# EAGLE design sanguinololu (EAGLE 5.11)
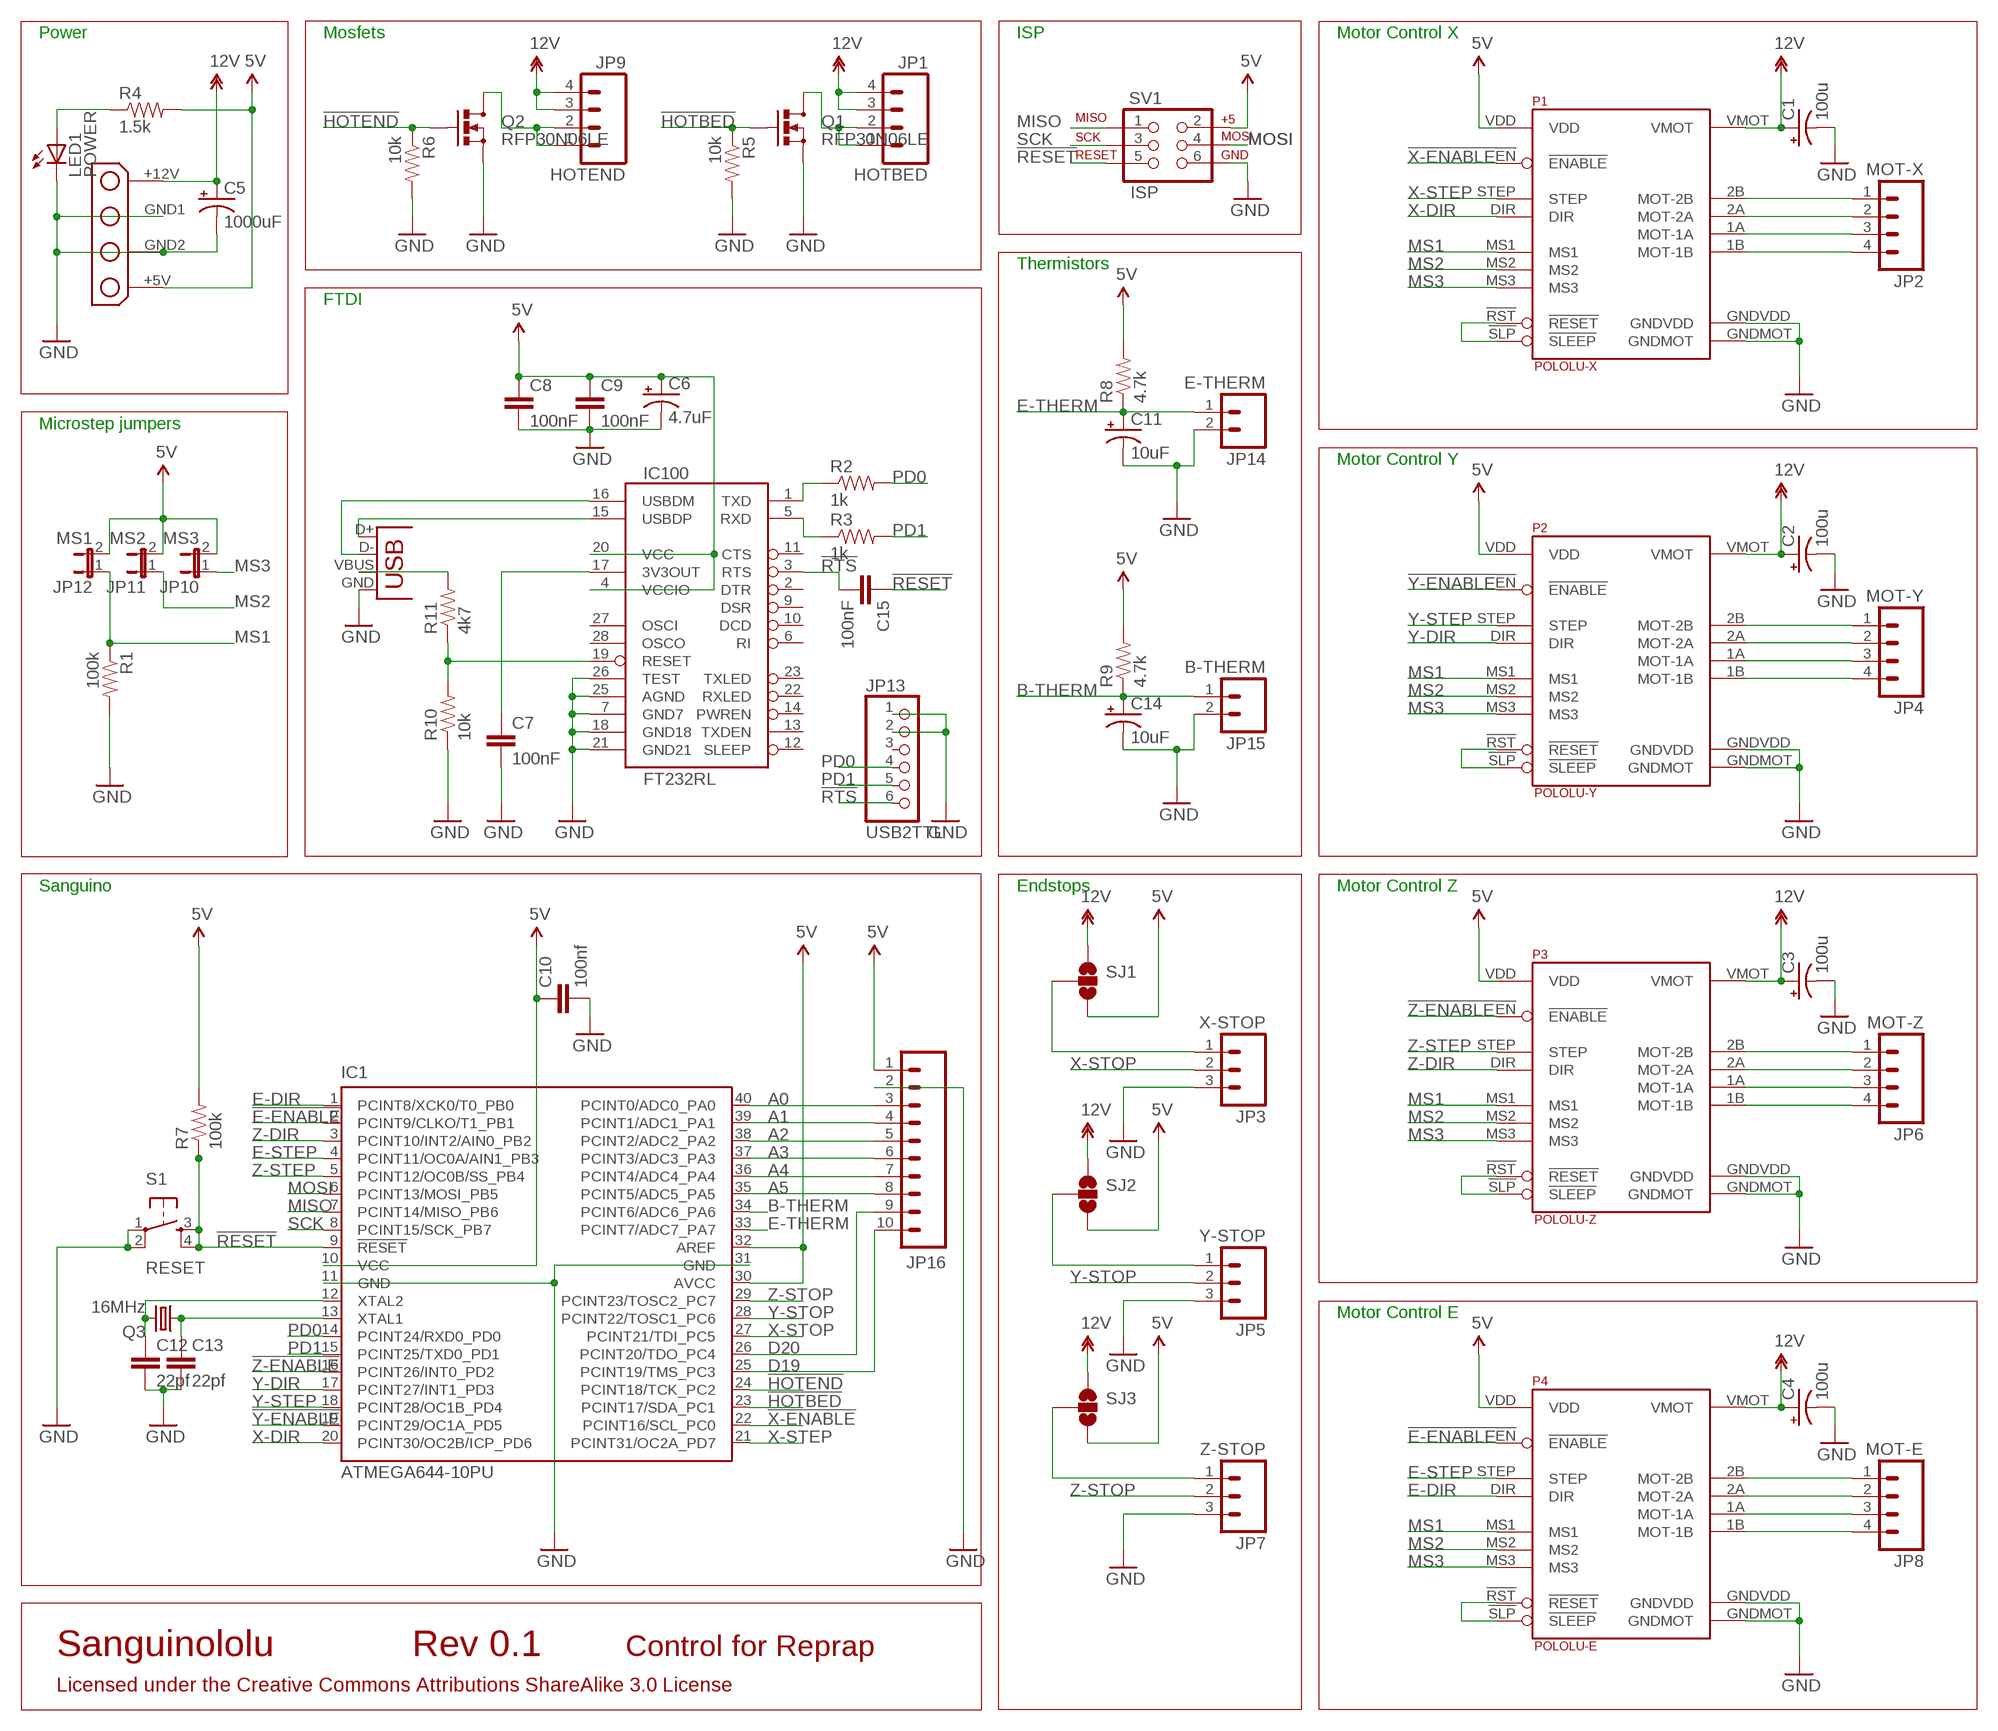
[diagram p0: schematic, sheet 1]

## Parts
C1  100u  CAP_POLPTH1  [CPOL-RADIAL-100UF-25V]
C2  100u  CAP_POLPTH1  [CPOL-RADIAL-100UF-25V]
C3  100u  CAP_POLPTH1  [CPOL-RADIAL-100UF-25V]
C4  100u  CAP_POLPTH1  [CPOL-RADIAL-100UF-25V]
C5  1000uF  CAP_POLPTH4  [CPOL-RADIAL-1000UF-25V]
C6  4.7uF  CAP_POLPTH2  [CPOL-RADIAL-10UF-25V]
C7  100nF  CAPPTH2  [CAP-PTH-SMALL2]
C8  100nF  CAPPTH2  [CAP-PTH-SMALL2]
C9  100nF  CAPPTH2  [CAP-PTH-SMALL2]
C10  100nf  CAPPTH2  [CAP-PTH-SMALL2]
C11  10uF  CAP_POLPTH2  [CPOL-RADIAL-10UF-25V]
C12  22pf  CAPPTH2  [CAP-PTH-SMALL2]
C13  22pf  CAPPTH2  [CAP-PTH-SMALL2]
C14  10uF  CAP_POLPTH2  [CPOL-RADIAL-10UF-25V]
C15  100nF  CAPPTH2  [CAP-PTH-SMALL2]
CONN1  DRIVEPWRVERTICAL  [MOLEX-4PIN-VERTICAL]
IC1  ATMEGA644-10PU  [DIL40]
IC100  FT232RL  FT232RLSSOP  [SSOP28DB]
J1  USB  USBPTH  [USB-B-PTH]
JP1  HOTBED  M04POLAR  [MOLEX-1X4]
JP2  MOT-X  M04POLAR  [MOLEX-1X4]
JP3  X-STOP  M03POLAR  [MOLEX-1X3]
JP4  MOT-Y  M04POLAR  [MOLEX-1X4]
JP5  Y-STOP  M03POLAR  [MOLEX-1X3]
JP6  MOT-Z  M04POLAR  [MOLEX-1X4]
JP7  Z-STOP  M03POLAR  [MOLEX-1X3]
JP8  MOT-E  M04POLAR  [MOLEX-1X4]
JP9  HOTEND  M04POLAR  [MOLEX-1X4]
JP10  MS3  JUMPER-2PTH  [1X02]
JP11  MS2  JUMPER-2PTH  [1X02]
JP12  MS1  JUMPER-2PTH  [1X02]
JP13  USB2TTL  PINHD-1X6  [1X06]
JP14  E-THERM  M02PTH  [1X02]
JP15  B-THERM  M02PTH  [1X02]
JP16  M10"  [1X10]
LED1  POWER  LED3MM  [LED3MM]
P1  POLOLU-X  POLOLU-ALLEGRO  [POLOLU-ALLEGRO-PTH]
P2  POLOLU-Y  POLOLU-ALLEGRO  [POLOLU-ALLEGRO-PTH]
P3  POLOLU-Z  POLOLU-ALLEGRO  [POLOLU-ALLEGRO-PTH]
P4  POLOLU-E  POLOLU-ALLEGRO  [POLOLU-ALLEGRO-PTH]
Q1  RFP30N06LE  MOSFET-NCHANNELPTH2  [TO220V]
Q2  RFP30N06LE  MOSFET-NCHANNELPTH2  [TO220V]
Q3  16MHz  CRYSTALHC49US  [HC49US]
R1  100k  RESISTORPTH1  [AXIAL-0.3]
R2  1k  RESISTORPTH1  [AXIAL-0.3]
R3  1k  RESISTORPTH1  [AXIAL-0.3]
R4  1.5k  RESISTORPTH1  [AXIAL-0.3]
R5  10k  RESISTORPTH1  [AXIAL-0.3]
R6  10k  RESISTORPTH1  [AXIAL-0.3]
R7  100k  RESISTORPTH1  [AXIAL-0.3]
R8  4.7k  RESISTORPTH1  [AXIAL-0.3]
R9  4.7k  RESISTORPTH1  [AXIAL-0.3]
R10  10k  RESISTORPTH1  [AXIAL-0.3]
R11  4k7  RESISTORPTH1  [AXIAL-0.3]
S1  RESET  TAC_SWITCHPTH  [TACTILE-PTH]
SJ1  SOLDERJUMPER_2WAYS  [SJ_3]
SJ2  SOLDERJUMPER_2WAYS  [SJ_3]
SJ3  SOLDERJUMPER_2WAYS  [SJ_3]
SV1  ISP  AVR_SPI_PRG_6PTH  [2X3]

## Nets
3V3: C7.1 IC100.17(3V3OUT)
5V: C6.1(+) C8.1 C9.1 C10.1 CONN1.+5V IC1.10(VCC) IC1.30(AVCC) IC1.32(AREF) IC100.4(VCCIO) IC100.20(VCC) JP10.2 JP11.2 JP12.2 JP16.1 P1.VDD P2.VDD P3.VDD P4.VDD R4.P$2 R7.P$2 R8.P$2 R9.P$2 SJ1.3 SJ2.3 SJ3.3 SV1.2
12V: C1.1(+) C2.1(+) C3.1(+) C4.1(+) C5.1(+) CONN1.+12V JP1.3 JP1.4 JP9.3 JP9.4 P1.VMOT P2.VMOT P3.VMOT P4.VMOT SJ1.1 SJ2.1 SJ3.1
!E-ENABLE: IC1.2(PCINT9/CLKO/T1_PB1) P4.!EN(!ENABLE)
!HOTBED: IC1.23(PCINT17/SDA_PC1) Q1.1(G) R5.P$1
!HOTEND: IC1.24(PCINT18/TCK_PC2) Q2.1(G) R6.P$1
!RESET: C15.1 IC1.9(!RESET) R7.P$1 S1.3 S1.4 SV1.5
!RTS: C15.2 IC100.3(RTS) JP13.6
!USB-RESET: IC100.19(RESET) R10.P$2 R11.P$1
!X-ENABLE: IC1.22(PCINT16/SCL_PC0) P1.!EN(!ENABLE)
!Y-ENABLE: IC1.19(PCINT29/OC1A_PD5) P2.!EN(!ENABLE)
!Z-ENABLE: IC1.16(PCINT26/INT0_PD2) P3.!EN(!ENABLE)
A0: IC1.40(PCINT0/ADC0_PA0) JP16.3
A1: IC1.39(PCINT1/ADC1_PA1) JP16.4
A2: IC1.38(PCINT2/ADC2_PA2) JP16.5
A3: IC1.37(PCINT3/ADC3_PA3) JP16.6
A4: IC1.36(PCINT4/ADC4_PA4) JP16.7
A5: IC1.35(PCINT5/ADC5_PA5) JP16.8
B-THERM: C14.1(+) IC1.34(PCINT6/ADC6_PA6) JP15.1 R9.P$1
D19: IC1.25(PCINT19/TMS_PC3) JP16.10
D20: IC1.26(PCINT20/TDO_PC4) JP16.9
E-DIR: IC1.1(PCINT8/XCK0/T0_PB0) P4.DIR
E-MOT-1A1: JP8.3 P4.1A(MOT-1A)
E-MOT-1B1: JP8.4 P4.1B(MOT-1B)
E-MOT-2A1: JP8.2 P4.2A(MOT-2A)
E-MOT-2B1: JP8.1 P4.2B(MOT-2B)
E-RESETSLEEP: P4.!RST(!RESET) P4.!SLP(!SLEEP)
E-STEP: IC1.4(PCINT11/OC0A/AIN1_PB3) P4.STEP
E-THERM: C11.1(+) IC1.33(PCINT7/ADC7_PA7) JP14.1 R8.P$1
GND [power]: C1.2(-) C2.2(-) C3.2(-) C4.2(-) C5.2(-) C6.2(-) C7.2 C8.2 C9.2 C10.2 C11.2(-) C12.2 C13.2 C14.2(-) CONN1.GND1(GND) CONN1.GND2(_GND) IC1.11(GND) IC1.31(GND) IC100.7(GND7) IC100.18(GND18) IC100.21(GND21) IC100.25(AGND) IC100.26(TEST) J1.GND JP3.3 JP5.3 JP7.3 JP13.1 JP13.2 JP14.2 JP15.2 JP16.2 LED1.K(C) P1.GNDMOT P1.GNDVDD P2.GNDMOT P2.GNDVDD P3.GNDMOT P3.GNDVDD P4.GNDMOT P4.GNDVDD Q1.3(S) Q2.3(S) R1.P$2 R5.P$2 R6.P$2 R10.P$1 S1.1 S1.2 SV1.6
HOTBED-GND: JP1.1 JP1.2 Q1.2(D)
HOTEND-GND: JP9.1 JP9.2 Q2.2(D)
LED1: LED1.A R4.P$1
MISO: IC1.7(PCINT14/MISO_PB6) SV1.1
MOSI: IC1.6(PCINT13/MOSI_PB5) SV1.4
MS1: JP12.1 P1.MS1 P2.MS1 P3.MS1 P4.MS1 R1.P$1
MS2: JP11.1 P1.MS2 P2.MS2 P3.MS2 P4.MS2
MS3: JP10.1 P1.MS3 P2.MS3 P3.MS3 P4.MS3
N$2: JP5.1 SJ2.2
N$3: JP7.1 SJ3.2
N$5: JP3.1 SJ1.2
PD0: IC1.14(PCINT24/RXD0_PD0) JP13.4 R2.P$2
PD1: IC1.15(PCINT25/TXD0_PD1) JP13.5 R3.P$2
SCK: IC1.8(PCINT15/SCK_PB7) SV1.3
USB-RXD: IC100.5(RXD) R3.P$1
USB-TXD: IC100.1(TXD) R2.P$1
USBDM: IC100.16(USBDM) J1.D-
USBDP: IC100.15(USBDP) J1.D+
VBUS: J1.VBUS R11.P$2
X-DIR: IC1.20(PCINT30/OC2B/ICP_PD6) P1.DIR
X-MOT-1A: JP2.3 P1.1A(MOT-1A)
X-MOT-1B: JP2.4 P1.1B(MOT-1B)
X-MOT-2A: JP2.2 P1.2A(MOT-2A)
X-MOT-2B: JP2.1 P1.2B(MOT-2B)
X-RESETSLEEP: P1.!RST(!RESET) P1.!SLP(!SLEEP)
X-STEP: IC1.21(PCINT31/OC2A_PD7) P1.STEP
X-STOP: IC1.27(PCINT21/TDI_PC5) JP3.2
XTAL1: C13.1 IC1.13(XTAL1) Q3.1
XTAL2: C12.1 IC1.12(XTAL2) Q3.2
Y-DIR: IC1.17(PCINT27/INT1_PD3) P2.DIR
Y-MOT-1A: JP4.3 P2.1A(MOT-1A)
Y-MOT-1B: JP4.4 P2.1B(MOT-1B)
Y-MOT-2A: JP4.2 P2.2A(MOT-2A)
Y-MOT-2B: JP4.1 P2.2B(MOT-2B)
Y-RESETSLEEP: P2.!RST(!RESET) P2.!SLP(!SLEEP)
Y-STEP: IC1.18(PCINT28/OC1B_PD4) P2.STEP
Y-STOP: IC1.28(PCINT22/TOSC1_PC6) JP5.2
Z-DIR: IC1.3(PCINT10/INT2/AIN0_PB2) P3.DIR
Z-MOT-1A: JP6.3 P3.1A(MOT-1A)
Z-MOT-1B: JP6.4 P3.1B(MOT-1B)
Z-MOT-2A: JP6.2 P3.2A(MOT-2A)
Z-MOT-2B: JP6.1 P3.2B(MOT-2B)
Z-RESETSLEEP: P3.!RST(!RESET) P3.!SLP(!SLEEP)
Z-STEP: IC1.5(PCINT12/OC0B/SS_PB4) P3.STEP
Z-STOP: IC1.29(PCINT23/TOSC2_PC7) JP7.2
Unconnected: IC100.2(DTR) IC100.6(RI) IC100.9(DSR) IC100.10(DCD) IC100.11(CTS) IC100.12(SLEEP) IC100.13(TXDEN) IC100.14(PWREN) IC100.22(RXLED) IC100.23(TXLED) IC100.27(OSCI) IC100.28(OSCO) JP13.3

## Notes on the sheet
- Power | Mosfets | ISP | Motor Control X
- Thermistors
- FTDI
- Microstep jumpers
- Motor Control Y
- Sanguino | Endstops | Motor Control Z
- Motor Control E
- Sanguinololu | Rev 0.1 | Control for Reprap
- Licensed under the Creative Commons Attributions ShareAlike 3.0 License

## Library data of the parts
C1-C6 C11 C14 = SparkFun:CAP_POL: Capacitor Polarized These are standard SMD and PTH capacitors. Normally 10uF, 47uF, and 100uF in electrolytic and tantalum varieties. Always verify the external diameter of the through hole cap, it varies with capacity, voltage, and manufacturer. The EIA devices should be standard.
C7-C10 C12 C13 C15 = SparkFun:CAP: Capacitor Standard 0603 ceramic capacitor, and 0.1" leaded capacitor.
CONN1 = molex-harddrive:DRIVEPWR
IC1 = atmel:ATMEGA644-*PU: 8-bit Microcontroller with 64K Bytes In-System Programmable Flash Auto generated by make-symbol-device-package-bsdl.ulp Rev. 34 Source: http://www.atmel.com/dyn/resources/prod_documents/doc2593.pdf; MPN: ATMEGA644V-10PU; OC_FARNELL: 1288342; OC_NEWARK: 23M5062
IC100 = SparkFun:FT232RL: USB UART FT232RL 4th Generation USB UART (USB <-> Serial) Controller. Spark Fun Electronics SKU : COM-00650
J1 = SparkFun:USB: USB Connectors USB-B-PTH is fully proven SKU : PRT-00139 USB-miniB is fully proven SKU : PRT-00587 USB-A-PCB is untested. USB-A-H is throughly reviewed, but untested. Spark Fun Electronics SKU : PRT-00437 USB-B-SMT is throughly reviewed, but untested. Needs silkscreen touching up. USB-A-S has not been used/tested USB-MB-H has not been used/tested
JP1 JP2 JP4 JP6 JP8 JP9 = SparkFun:M04: Header 4 Standard 4-pin 0.1" header. Use with straight break away headers (SKU : PRT-00116), right angle break away headers (PRT-00553), swiss pins (PRT-00743), machine pins (PRT-00117), and female headers (PRT-00115). Molex polarized connector foot print use with SKU : PRT-08231 with associated crimp pins and housings.
JP3 JP5 JP7 = SparkFun:M03: Header 3 Standard 3-pin 0.1" header. Use with straight break away headers (SKU : PRT-00116), right angle break away headers (PRT-00553), swiss pins (PRT-00743), machine pins (PRT-00117), and female headers (PRT-00115). Molex polarized connector foot print use with SKU : PRT-08232 with associated crimp pins and housings.
JP10-JP12 = SparkFun:JUMPER-2: Jumper Basic 0.1" spaced jumper. Use with breakaway headers.
JP13 = pinhead:PINHD-1X6: PIN HEADER
JP14 JP15 = SparkFun:M02: Header 2 Standard 2-pin 0.1" header. Use with straight break away headers (SKU : PRT-00116), right angle break away headers (PRT-00553), swiss pins (PRT-00743), machine pins (PRT-00117), and female headers (PRT-00115). Molex polarized connector foot print use with SKU : PRT-08233 with associated crimp pins and housings.
JP16 = SparkFun:M10: Header 10 Standard 10-pin 0.1" header. Use with straight break away headers (SKU : PRT-00116), right angle break away headers (PRT-00553), swiss pins (PRT-00743), machine pins (PRT-00117), and female headers (PRT-00115).
LED1 = SparkFun:LED: LEDs Standard schematic elements and footprints for 5mm, 3mm, 1206, and 0603 sized LEDs. 5mm - Spark Fun Electronics SKU : COM-00529 (and others)
P1-P4 = pololu-allegro:POLOLU-ALLEGRO
Q1 Q2 = SparkFun:MOSFET-NCHANNEL
Q3 = SparkFun:CRYSTAL: Crystals Various standard crystals. Proven footprints. Spark Fun Electronics SKU : COM-00534
R1-R11 = SparkFun:RESISTOR: Resistor Basic schematic elements and footprints for 0603, 1206, and PTH 1/10th watt (small) resistors.
S1 = SparkFun:TAC_SWITCH: Momentary Switch Button commonly used for reset or general input. Spark Fun Electronics SKU : COM-00097
SJ1-SJ3 = SparkFun:SOLDERJUMPER_2WAY: Solder Jumper 2 way solder jumper
SV1 = SparkFun:AVR_SPI_PRG_6: AVR ISP 6 Pin This is the reduced ISP connector for AVR programming. Common on Arduino. This footprint will take up less PCB space and can be used with a 10-pin to 6-pin adapter such as SKU: BOB-08508

## Board
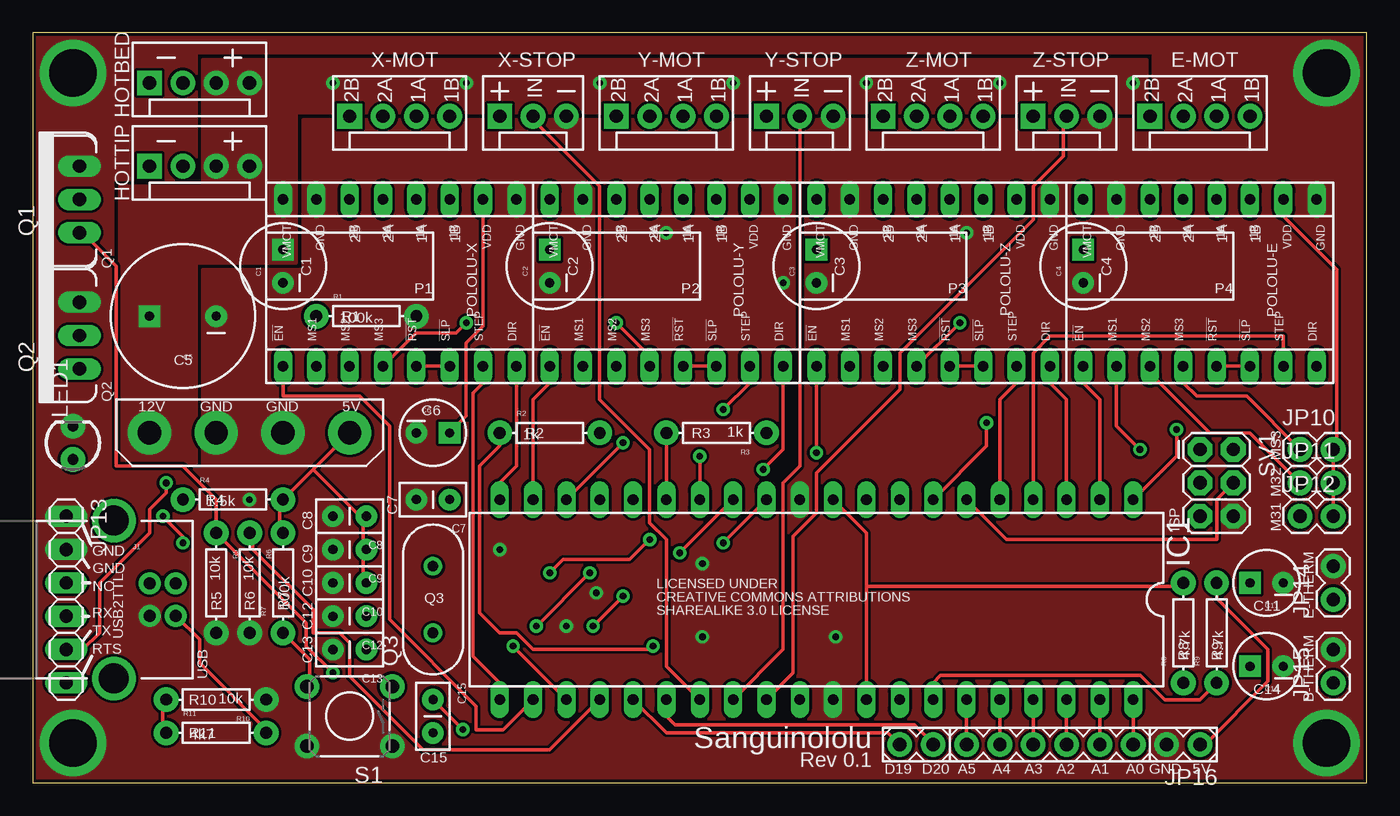
[diagram p1: board, top side]
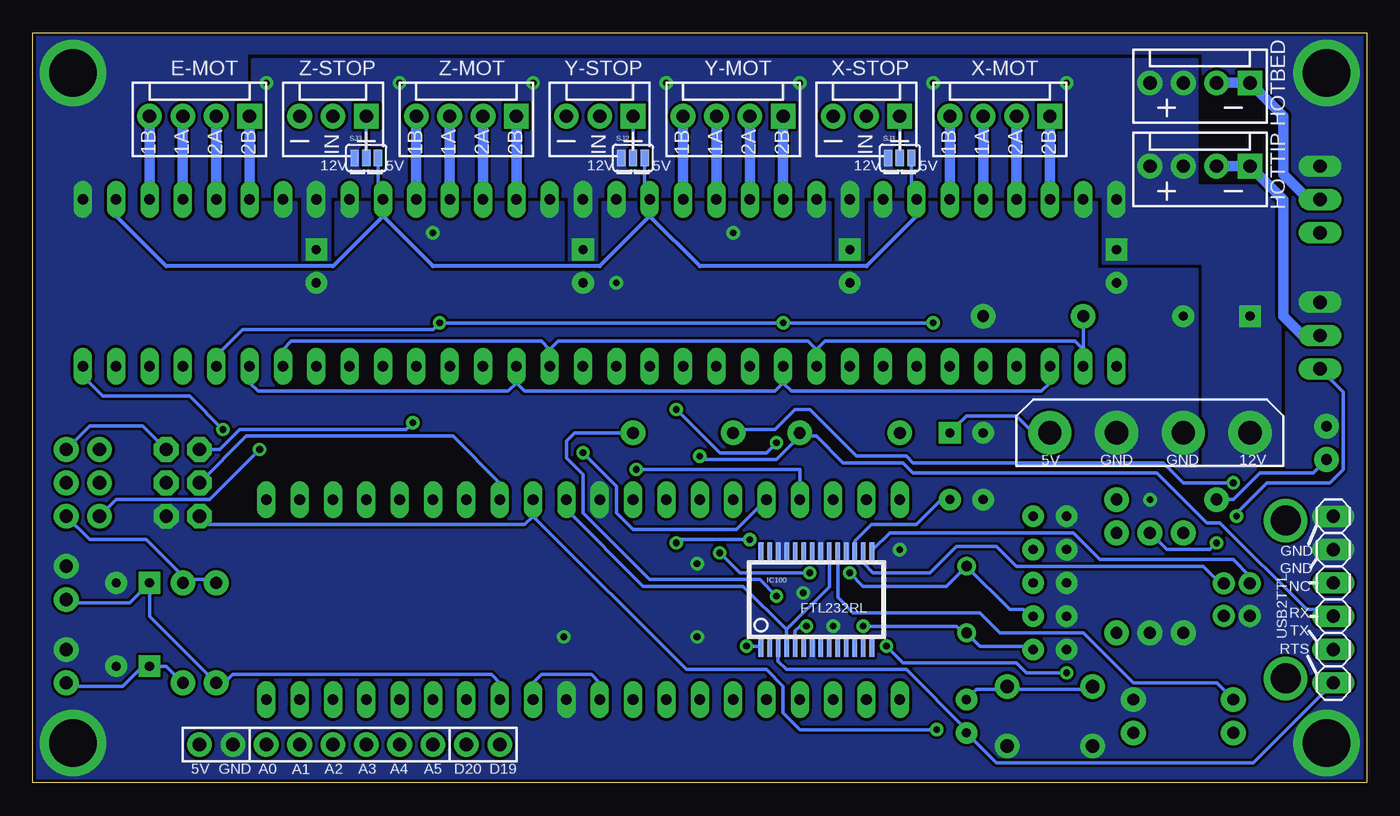
[diagram p2: board, bottom side, seen from below]

Size 101.6 x 57.15 mm. Coordinates in mm from the lower left corner, seen from the top.
Outline: 0,0 101.6,0 101.6,57.15 0,57.15 0,0
Copper layers (1*16): Top 0.035mm / dielectric 1.5mm / Bottom 0.035mm
Design rules "SparkFun *": minimum track width 10mil, minimum drill 20mil, track to track 8mil, track to pad 8mil, pad to pad 8mil, via to via 8mil, smd to smd 8mil, copper to edge 10mil, drill to drill 8mil, minimum pad ring 12mil, minimum via ring 10mil, stop-mask expansion 4mil, vias tented up to drill 25mil, thermal gap 10mil

### Footprints (pad centres in the part's own frame; a part is rotated, then mirrored left to right if it is on the bottom)
CPOL-RADIAL-100UF-25V = drill 0.7 pad 1.651 square: 1 1.27,0 | drill 0.7 pad 1.651 round: 2 -1.27,0
CPOL-RADIAL-1000UF-25V = drill 0.7 pad 1.651 square: 1 2.54,0 | drill 0.7 pad 1.651 round: 2 -2.54,0
CPOL-RADIAL-10UF-25V = drill 0.7 pad 1.651 square: 1 1.27,0 | drill 0.7 pad 1.651 round: 2 -1.27,0
CAP-PTH-SMALL2 = drill 0.7 pad 1.651 round: 1 0,0; 2 2.54,0
MOLEX-4PIN-VERTICAL = drill 1.778 pad 3.302 round: +5V -15.24,0; +12V 0,0; GND1 -10.16,0; GND2 -5.08,0
DIL40 = drill 0.813 long: 1 -24.13,-7.62; 2 -21.59,-7.62; 3 -19.05,-7.62; 4 -16.51,-7.62; 5 -13.97,-7.62; 6 -11.43,-7.62; 7 -8.89,-7.62; 8 -6.35,-7.62; 9 -3.81,-7.62; 10 -1.27,-7.62; 11 1.27,-7.62; 12 3.81,-7.62; 13 6.35,-7.62; 14 8.89,-7.62; 15 11.43,-7.62; 16 13.97,-7.62; 17 16.51,-7.62; 18 19.05,-7.62; 19 21.59,-7.62; 20 24.13,-7.62; 21 24.13,7.62; 22 21.59,7.62; 23 19.05,7.62; 24 16.51,7.62; 25 13.97,7.62; 26 11.43,7.62; 27 8.89,7.62; 28 6.35,7.62; 29 3.81,7.62; 30 1.27,7.62; 31 -1.27,7.62; 32 -3.81,7.62; 33 -6.35,7.62; 34 -8.89,7.62; 35 -11.43,7.62; 36 -13.97,7.62; 37 -16.51,7.62; 38 -19.05,7.62; 39 -21.59,7.62; 40 -24.13,7.62
SSOP28DB = smd 0.348 x 1.397: 1 -4.225,-3.656; 2 -3.575,-3.656; 3 -2.925,-3.656; 4 -2.275,-3.656; 5 -1.625,-3.656; 6 -0.975,-3.656; 7 -0.325,-3.656; 8 0.325,-3.656; 9 0.975,-3.656; 10 1.625,-3.656; 11 2.275,-3.656; 12 2.925,-3.656; 13 3.575,-3.656; 14 4.225,-3.656; 15 4.225,3.656; 16 3.575,3.656; 17 2.925,3.656; 18 2.275,3.656; 19 1.625,3.656; 20 0.975,3.656; 21 0.325,3.656; 22 -0.325,3.656; 23 -0.975,3.656; 24 -1.625,3.656; 25 -2.275,3.656; 26 -2.925,3.656; 27 -3.575,3.656; 28 -4.225,3.656
USB-B-PTH = drill 0.914 pad 1.676 round: D+ 0,1.25; D- 1.981,1.25; GND 0,-1.25; VBUS 1.981,-1.25 | drill 2.286 round: P$1 -2.718,-6.02; P$2 -2.718,6.02
MOLEX-1X4 = drill 1.016 pad 1.88 square: 1 0,0 | drill 1.016 pad 1.88 round: 2 2.54,0; 3 5.08,0; 4 7.62,0
MOLEX-1X3 = drill 1.016 pad 1.88 square: 1 0,0 | drill 1.016 pad 1.88 round: 2 2.54,0; 3 5.08,0
1X02 = drill 1.016 pad 1.88 round: 1 0,0; 2 2.54,0
1X06 = drill 1.016 long: 1 -6.35,0; 2 -3.81,0; 3 -1.27,0; 4 1.27,0; 5 3.81,0; 6 6.35,0
1X10 = drill 1.016 pad 1.88 round: 1 0,0; 2 2.54,0; 3 5.08,0; 4 7.62,0; 5 10.16,0; 6 12.7,0; 7 15.24,0; 8 17.78,0; 9 20.32,0; 10 22.86,0
LED3MM = drill 0.813 pad 1.88 round: A -1.27,0; K 1.27,0
POLOLU-ALLEGRO-PTH = drill 0.8 pad 1.422 long: 1A 6.35,-1.27; 1B 6.35,-3.81; 2A 6.35,1.27; 2B 6.35,3.81; !EN -6.35,8.89; !RST -6.35,-1.27; !SLP -6.35,-3.81; DIR -6.35,-8.89; GNDMOT 6.35,6.35; GNDVDD 6.35,-8.89; MS1 -6.35,6.35; MS2 -6.35,3.81; MS3 -6.35,1.27; STEP -6.35,-6.35; VDD 6.35,-6.35; VMOT 6.35,8.89
TO220V = drill 1.016 long: 1 -2.54,0; 2 0,0; 3 2.54,0
HC49US = drill 0.813 round: 1 -2.54,0; 2 2.54,0
AXIAL-0.3 = drill 0.9 pad 1.88 round: P$1 -3.81,0; P$2 3.81,0
TACTILE-PTH = drill 1.016 pad 1.88 round: 1 -3.251,2.261; 2 3.251,2.261; 3 -3.251,-2.261; 4 3.251,-2.261
SJ_3 = smd 0.635 x 1.27: 1 -0.889,0; 2 0,0; 3 0.889,0
2X3 = drill 1.016 pad 1.88 octagon: 1 0,0; 2 0,2.54; 3 2.54,0; 4 2.54,2.54; 5 5.08,0; 6 5.08,2.54

### Placement (x,y rotation side)
C1  19.05,39.37 90 top
C2  39.37,39.37 90 top
C3  59.69,39.37 90 top
C4  80.01,39.37 90 top
C5  11.43,35.56 180 top
C6  30.48,26.67 0 top
C7  31.75,21.59 180 top
C8  25.4,20.32 180 top
C9  25.4,17.78 180 top
C10  25.4,15.24 180 top
C11  93.98,15.24 180 top
C12  25.4,12.7 180 top
C13  25.4,10.16 180 top
C14  93.98,8.89 180 top
C15  30.48,6.35 270 top
CONN1  8.89,26.67 180 top
IC1  59.69,13.97 180 top
IC100  41.91,13.97 0 bottom
J1  8.89,13.97 0 top
JP1  8.89,53.34 0 top
JP2  24.13,50.8 0 top
JP3  35.56,50.8 0 top
JP4  44.45,50.8 0 top
JP5  55.88,50.8 0 top
JP6  64.77,50.8 0 top
JP7  76.2,50.8 0 top
JP8  85.09,50.8 0 top
JP9  8.89,46.99 0 top
JP10  96.52,25.4 0 top
JP11  96.52,22.86 0 top
JP12  96.52,20.32 0 top
JP13  2.54,13.97 270 top
JP14  99.06,13.97 90 top
JP15  99.06,7.62 90 top
JP16  88.9,2.92 180 top
LED1  3.05,25.91 90 top
P1  27.94,38.1 90 top
P2  48.26,38.1 90 top
P3  68.58,38.1 90 top
P4  88.9,38.1 90 top
Q1  3.56,44.45 90 top
Q2  3.56,34.09 90 top
Q3  30.48,13.97 90 top
R1  25.4,35.56 0 top
R2  39.37,26.67 0 top
R3  52.07,26.67 180 top
R4  15.24,21.59 0 top
R5  13.97,15.24 270 top
R6  16.51,15.24 270 top
R7  19.05,15.24 90 top
R8  87.63,11.43 90 top
R9  90.17,11.43 90 top
R10  13.97,6.35 180 top
R11  13.97,3.81 0 top
S1  24.13,5.08 180 top
SJ1  35.56,47.62 0 bottom
SJ2  55.88,47.62 0 bottom
SJ3  76.2,47.62 0 bottom
SV1  88.9,25.4 270 top

### Tracks (layer width: path | path; a pad name or v marks a point on that pad's centre or on a via)
3V3
  Bottom 0.254: IC100.17 38.98,18.42 37.72,19.68 34.29,19.68 32.38,21.59 C7.1
5V
  Top 0.254: IC1.10 63.5,19.05 63.5,14.99 | 63.5,14.99 IC1.32 | C10.1 25.15,15.49 25.15,17.53 | 25.15,20.07 25.15,17.53 | 25.15,17.53 C9.1 | R7.P$2 18.8,19.3 18.8,21.34 R4.P$2 21.34,23.88 | 21.34,23.88 CONN1.+5V | 21.34,23.88 25.15,20.07 | 25.15,20.07 C8.1 | P4.VDD 95.25,43.18 99.31,39.12 99.31,25.65 JP10.2 JP11.2 JP12.2 | C6.1 33.02,27.94 33.02,33.53 34.29,34.8 P1.VDD | 63.5,14.99 87.63,14.99 R8.P$2 | JP16.1 89.28,2.92 94.08,7.72 94.08,10.16 90.17,14.07 R9.P$2
  Bottom 0.254: 44.2,11.68 47.5,14.99 55.12,14.99 60.96,20.83 IC1.10 | C6.1 30.48,27.94 26.67,27.94 25.4,26.67 CONN1.+5V | SV1.2 93.22,27.18 97.28,27.18 JP10.2 | R8.P$2 87.88,15.49 89.92,15.49 | 89.92,15.49 92.96,18.54 97.28,18.54 JP12.2 | 89.92,15.49 R9.P$2 | 44.2,11.68 40.94,14.95 IC100.20 | P1.VDD 34.67,44.45 SJ1.3 | P2.VDD 54.99,44.45 SJ2.3 | P3.VDD 75.31,44.45 SJ3.3 | IC1.30 58.42,7.62 59.05,8.26 62.87,8.26 63.5,7.62 IC1.32 | IC100.4 44.19,11.67 44.2,11.68
  Bottom 0.305: P1.VDD 34.29,43.18 38.1,39.37 50.8,39.37 54.61,43.18 | 54.61,43.18 58.42,39.37 71.12,39.37 74.93,43.18 | 74.93,43.18 78.74,39.37 91.44,39.37 95.25,43.18 P4.VDD | 74.93,43.18 P3.VDD | 54.61,43.18 P2.VDD
12V  (via drill 0.51)
  other vias: 22.86,53.34 33.02,53.34 53.34,53.34 43.18,53.34 63.5,53.34 83.82,53.34 73.66,53.34
  pour Bottom (no thermals): 12.95,55.12 12.95,45.47 6.6,45.47 6.6,24.38 12.45,24.38 12.45,39.62 20.07,39.62 20.07,44.7 38.35,44.7 38.35,39.62 40.39,39.62 40.39,44.7 58.67,44.7 58.67,39.62 60.71,39.62 60.71,44.7 78.99,44.7 78.99,39.62 81.03,39.62 81.03,44.7 84.84,44.7 84.84,55.12
  pour Top (no thermals): 6.6,24.38 12.45,24.38 12.45,39.62 20.07,39.62 20.07,51.05 84.84,51.05 84.84,55.12 12.95,55.12 12.95,45.47 6.6,45.47
!E-ENABLE
  Top 0.254: IC1.2 81.28,29.21 80.01,30.48 P4.!EN
!HOTBED  (via drill 0.51)
  Top 0.254: v36.58,10.41 IC1.23 | v22.86,8.38 20.83,10.41 20.83,12.19 R5.P$1 13.97,21.59 11.43,24.13 6.35,24.13 6.35,39.37 3.81,41.91 Q1.1
  Bottom 0.254: v36.58,10.41 35.31,9.14 26.67,9.14 25.91,8.38 v22.86,8.38
!HOTEND  (via drill 0.51)
  Top 0.254: IC1.24 39.37,2.54 29.72,2.54 24.13,8.13 24.13,10.67 23.37,11.43 21.34,11.43 21.34,13.21 16.76,17.78 16.76,18.8 R6.P$1 | v9.91,20.32 11.43,18.8 v11.43,18.29
  Bottom 0.254: R6.P$1 15.24,17.78 11.94,17.78 v11.43,18.29 | v9.91,20.32 9.91,20.57 7.62,22.86 2.79,22.86 1.78,23.88 1.78,29.77 Q2.1
!RESET  (via drill 0.51)
  Top 0.254: R7.P$1 21.08,9.4 21.08,7.37 S1.4 | C15.1 v32.77,4.06
  Bottom 0.254: C15.1 29.72,7.11 27.43,7.11 S1.3 27.18,7.11 21.08,7.11 S1.4 | v32.77,4.06 43.18,4.06 44.45,5.33 44.45,7.37 45.72,8.64 51.82,8.64 63.5,20.32 | 63.5,20.32 IC1.9 | 63.5,20.32 64.14,19.68 88.27,19.68 SV1.5
!RTS
  Bottom 0.254: JP13.6 8.64,1.52 28.19,1.52 C15.2 30.48,4.06 35.05,8.64 44.2,8.64 44.84,9.28 IC100.3
!USB-RESET
  Top 0.254: R11.P$1 9.91,4.06 9.91,6.1 R10.P$2
  Bottom 0.254: IC100.19 40.28,14.12 39.12,12.95 29.46,12.95 27.94,11.43 21.59,11.43 17.78,7.62 11.43,7.62 R10.P$2
!X-ENABLE
  Top 0.254: IC1.22 35.81,4.06 33.78,4.06 33.78,5.84 27.18,12.45 27.18,27.18 24.89,29.46 19.05,29.46 P1.!EN
!Y-ENABLE
  Top 0.254: IC1.19 38.1,29.21 39.37,30.48 P2.!EN
!Z-ENABLE  (via drill 0.51)
  Top 0.254: v59.69,25.15 P3.!EN
  Bottom 0.254: IC1.16 48.01,19.3 55.88,19.3 57.15,20.57 57.15,22.61 v59.69,25.15
A0
  Top 0.254: JP16.3 IC1.40
A1
  Top 0.254: JP16.4 IC1.39
A2
  Top 0.254: JP16.5 IC1.38
A3
  Top 0.254: JP16.6 IC1.37
A4
  Top 0.254: JP16.7 IC1.36
A5
  Top 0.254: JP16.8 IC1.35
B-THERM
  Top 0.254: IC1.34 68.58,7.62 69.14,8.18 84.38,8.18 86.21,6.35 88.9,6.35 R9.P$1
  Bottom 0.254: JP15.1 98.81,7.37 94.74,7.37 93.22,8.89 C14.1 91.44,8.89 R9.P$1
D19
  Top 0.254: IC1.25 48.26,3.81 65.15,3.81 JP16.10
D20
  Top 0.254: IC1.26 48.26,5.08 48.92,4.42 67.16,4.42 68.58,3 JP16.9
E-DIR  (via drill 0.51)
  Top 0.254: IC1.1 87.12,24.89 v87.12,26.92
  Bottom 0.254: v87.12,26.92 89.66,29.46 96.27,29.46 97.79,30.99 P4.DIR
E-MOT-1A1
  Bottom 0.813: P4.1A JP8.3
E-MOT-1B1
  Bottom 0.813: P4.1B JP8.4
E-MOT-2A1
  Bottom 0.813: P4.2A JP8.2
E-MOT-2B1
  Bottom 0.813: P4.2B JP8.1
E-RESETSLEEP
  Top 0.254: P4.!RST P4.!SLP
E-STEP
  Top 0.254: IC1.4 76.2,32.77 77.47,34.04 95.25,34.04 P4.STEP
E-THERM
  Bottom 0.254: JP14.1 98.81,13.72 94.23,13.72 C11.1 92.71,12.7 R8.P$1 87,7.62 86.36,8.26 66.67,8.26 66.04,7.62 IC1.33
GND  (via drill 0.51, 3.6 pad 5.08)
  other vias: 98.55,54.1 98.55,3.05 3.05,3.05 3.05,54.1 57.15,38.1 51,16.71 40.64,11.94 42.93,14.48 48.26,41.91 71.12,41.91 16.51,21.59 35.56,17.78 51,11.13 61.16,11.13
  pour Top (no thermals): 0,57.15 85.22,57.15 85.22,55.63 12.45,55.63 12.45,45.97 6.1,45.97 6.1,23.88 12.95,23.88 12.95,39.12 20.57,39.12 20.57,50.55 85.34,50.55 85.34,57.15 101.6,57.15 101.6,0 0,0
  pour Bottom (no thermals): 0,57.15 85.22,57.15 85.22,55.63 12.45,55.63 12.45,45.97 6.1,45.97 6.1,23.88 12.95,23.88 12.95,39.12 20.57,39.12 20.57,44.2 37.85,44.2 37.85,39.12 40.89,39.12 40.89,44.2 58.17,44.2 58.17,39.12 61.21,39.12 61.21,44.2 78.49,44.2 78.49,39.12 81.53,39.12 81.53,44.2 85.34,44.2 85.34,57.15 101.6,57.15 101.6,0 0,0
HOTBED-GND
  Bottom 0.813: JP1.2 JP1.1 6.35,50.8 6.35,46.38 4.42,44.45 Q1.2
HOTEND-GND
  Bottom 0.813: JP9.2 JP9.1 6.35,44.45 6.35,35.56 4.83,34.04 3.61,34.04 Q2.2
LED1
  Bottom 0.254: R4.P$1 10.16,21.59 8.13,23.62 4.06,23.62 LED1.A
MISO  (via drill 0.51)
  Top 0.254: IC1.7 72.64,25.65 v72.64,27.43
  Bottom 0.254: v72.64,27.43 73.15,26.92 85.85,26.92 87.38,25.4 SV1.1
MOSI
  Top 0.254: IC1.6 74.17,18.54 90.17,18.54 90.17,21.59 SV1.4
MS1  (via drill 0.51)
  Top 0.254: v84.33,25.4 82.55,27.18 P4.MS1
  Bottom 0.254: JP12.1 95.25,21.59 88.14,21.59 v84.33,25.4 | R1.P$1 P1.MS1 21.59,33.02 22.23,33.66 41.27,33.66 41.91,33.02 | 41.91,33.02 42.55,33.66 61.59,33.66 62.23,33.02 | 62.23,33.02 62.87,33.66 81.92,33.66 82.55,33.02 P4.MS1 | 62.23,33.02 P3.MS1 | 41.91,33.02 P2.MS1
MS2
  Top 0.254: P4.MS2 85.09,31.24 89.66,26.67 92.71,26.67 JP11.1
  Bottom 0.254: P1.MS2 24.13,30.48 24.77,29.84 43.81,29.84 44.45,30.48 | 44.45,30.48 45.09,29.84 64.14,29.84 64.77,30.48 | 64.77,30.48 65.41,29.84 84.45,29.84 85.09,30.48 P4.MS2 | 44.45,30.48 P2.MS2 | 64.77,30.48 P3.MS2
MS3  (via drill 0.51)
  Top 0.254: P1.MS3 29.21,34.29 32.26,34.29 v33.02,35.05 | v44.45,35.05 46.99,32.51 P2.MS3 | v70.61,35.05 P3.MS3 | JP10.1 92.46,29.46 88.65,29.46 87.63,30.48 P4.MS3
  Bottom 0.254: v33.02,35.05 v44.45,35.05 v70.61,35.05 71.12,34.54 85.6,34.54 87.63,32.51 P4.MS3
N$2
  Bottom 0.254: SJ2.2 JP5.1
N$3
  Bottom 0.254: SJ3.2 JP7.1
N$5
  Bottom 0.254: SJ1.2 JP3.1
PD0  (via drill 0.51)
  Top 0.254: v50.8,24.89 IC1.14
  Bottom 0.254: v50.8,24.89 50.55,24.64 44.96,24.64 43.18,26.42 | JP13.4 3.05,13.21 4.57,13.21 11.18,19.81 12.19,19.81 16,23.62 34.54,23.62 35.31,24.38 39.88,24.38 41.91,26.42 43.18,26.42 | 43.18,26.42 R2.P$2
PD1  (via drill 0.51)
  Top 0.254: R3.P$2 IC1.15 | v10.16,22.86 10.16,22.1 8.89,20.83 8.89,19.05 5.08,15.24 5.08,11.43 3.81,10.16 JP13.5
  Bottom 0.254: R3.P$2 48.01,26.92 45.09,26.92 43.56,28.45 42.42,28.45 38.86,24.89 35.05,24.89 34.54,24.38 15.49,24.38 13.97,22.86 v10.16,22.86
SCK
  Bottom 0.254: SV1.3 85.34,26.42 69.6,26.42 66.04,22.86 IC1.8
USB-RXD  (via drill 0.51)
  Top 0.254: v42.67,11.94 v44.96,14.22
  Bottom 0.254: v42.67,11.94 43.18,11.94 43.53,11.58 IC100.5 | v44.96,14.22 46.23,15.49 54.61,15.49 59.69,20.57 59.69,23.5 60.96,24.77 60.96,26.04 60.33,26.67 R3.P$1
USB-TXD  (via drill 0.51)
  Top 0.254: v47.24,10.41 46.99,10.16 38.1,10.16 36.83,11.43 35.56,11.43 34.04,12.95 34.04,24.13 35.56,25.65 R2.P$1
  Bottom 0.254: v47.24,10.41 46.23,10.41 IC100.1
USBDM
  Bottom 0.254: 38.35,17.53 IC100.16 38.34,16.75 37.59,16 33.27,16 31.24,18.03 28.19,18.03 26.67,16.51 12.45,16.51 11.18,15.24 10.92,15.24 J1.D-
USBDP
  Bottom 0.254: IC100.15 37.59,17.78 36.32,19.05 22.35,19.05 20.32,17.02 10.16,17.02 8.89,15.75 J1.D+
VBUS
  Top 0.254: R11.P$2 17.78,4.06 12.7,9.14 12.7,10.92 10.92,12.7 J1.VBUS
X-DIR
  Top 0.254: IC1.20 35.56,22.86 36.83,24.13 P1.DIR
X-MOT-1A
  Bottom 0.813: P1.1A JP2.3
X-MOT-1B
  Bottom 0.813: P1.1B JP2.4
X-MOT-2A
  Bottom 0.813: P1.2A JP2.2
X-MOT-2B
  Bottom 0.813: P1.2B JP2.1
X-RESETSLEEP
  Top 0.254: P1.!RST P1.!SLP
X-STEP
  Top 0.254: P1.STEP 34.29,30.48 33.53,29.72 33.53,9.65 35.56,7.62 IC1.21
X-STOP
  Top 0.254: IC1.27 48.26,8.89 48.26,18.54 46.99,19.81 46.99,25.4 43.18,29.21 43.18,45.47 38.1,50.55 JP3.2
XTAL1  (via drill 0.51)
  Top 0.254: v49.28,17.53 IC1.13 | v38.35,11.94 v42.42,16
  Bottom 0.254: C13.1 25.65,10.41 29.46,10.41 Q3.1 30.73,11.43 31.24,11.94 v38.35,11.94 | v49.28,17.53 47.75,16 v42.42,16
XTAL2  (via drill 0.51)
  Top 0.254: v52.58,18.29 IC1.12 | v46.99,18.54 45.47,17.02 40.39,17.02 v39.37,16
  Bottom 0.254: C12.1 25.65,12.7 26.16,13.21 27.18,13.21 Q3.2 32,14.99 38.35,14.99 v39.37,16 | v52.58,18.29 52.32,18.54 v46.99,18.54
Y-DIR  (via drill 0.51)
  Top 0.254: v55.63,23.88 57.15,25.4 P2.DIR
  Bottom 0.254: IC1.17 43.18,23.88 v55.63,23.88
Y-MOT-1A
  Bottom 0.813: P2.1A JP4.3
Y-MOT-1B
  Bottom 0.813: P2.1B JP4.4
Y-MOT-2A
  Bottom 0.813: P2.2A JP4.2
Y-MOT-2B
  Bottom 0.813: P2.2B JP4.1
Y-RESETSLEEP
  Top 0.254: P2.!RST P2.!SLP
Y-STEP  (via drill 0.51)
  Top 0.254: IC1.18 v44.96,25.91 | v52.58,28.45 54.61,30.48 P2.STEP
  Bottom 0.254: v44.96,25.91 45.72,25.15 49.28,25.15 v52.58,28.45
Y-STOP
  Top 0.254: IC1.28 57.15,10.16 57.15,22.86 58.42,24.13 JP5.2
Z-DIR
  Top 0.254: IC1.3 78.74,29.21 77.47,30.48 P3.DIR
Z-MOT-1A
  Bottom 0.813: P3.1A JP6.3
Z-MOT-1B
  Bottom 0.813: P3.1B JP6.4
Z-MOT-2A
  Bottom 0.813: P3.2A JP6.2
Z-MOT-2B
  Bottom 0.813: P3.2B JP6.1
Z-RESETSLEEP
  Top 0.254: P3.!RST P3.!SLP
Z-STEP
  Top 0.254: IC1.5 73.66,29.21 74.93,30.48 P3.STEP
Z-STOP
  Top 0.254: JP7.2 78.49,50.55 78.49,47.75 76.2,45.47 76.2,42.93 66.04,32.77 66.04,29.97 59.69,23.62 59.69,20.57 57.91,18.8 57.91,8.38 IC1.29

### Text on the board
_tsilk: X-MOT | X-STOP | Y-MOT | Y-STOP | Z-MOT | Z-STOP | E-MOT | 2B | 2A | 1A | 1B | IN | 2B | 2A | 1A | 1B | IN | 2B | 2A | 1A | 1B | IN | 2B | 2A | 1A | 1B | HOTBED | HOTTIP | 2B | 2A | 1A | 1B | 2B | 2A | 1A | 1B | 2B | 2A | 1A | 1B | 2B | 2A | 1A | 1B | POLOLU-X | POLOLU-Y | POLOLU-Z | POLOLU-E | Q1 | C1 | C2 | C3 | C4 | R1 | C5 | Q2 | 12V | GND | GND | 5V | C6 | MS3 | R2 | R3 | M32 | R4 | ISP | M31 | C7 | C8 | GND | C9 | GND | USB2TTL | NC | LICENSED UNDER | C10 | Q3 | CREATIVE COMMONS ATTRIBUTIONS | C11 | RX | R5 | R6 | R7 | SHAREALIKE 3.0 LICENSE | E-THERM | C12 | TX | RTS | USB | C13 | R8 | R9 | C14 | R10 | B-THERM | Sanguinololu | R11 | C15 | Rev 0.1 | D19 | D20 | A5 | A4 | A3 | A2 | A1 | A0 | GND | 5V
_bsilk: X-MOT | X-STOP | Y-MOT | Y-STOP | Z-MOT | Z-STOP | E-MOT | HOTBED | 2B | 2A | 1A | 1B | IN | 2B | 2A | 1A | 1B | IN | 2B | 2A | 1A | 1B | IN | 2B | 2A | 1A | 1B | 5V | 12V | 5V | 12V | 5V | 12V | HOTTIP | 12V | GND | GND | 5V | GND | GND | USB2TTL | NC | FTL232RL | RX | TX | RTS | D19 | D20 | A5 | A4 | A3 | A2 | A1 | A0 | GND | 5V